# EAGLE design rizon (EAGLE 8.4.1)
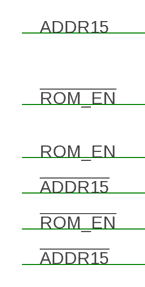
[diagram p0: schematic, sheet 1, part 1 of 2]
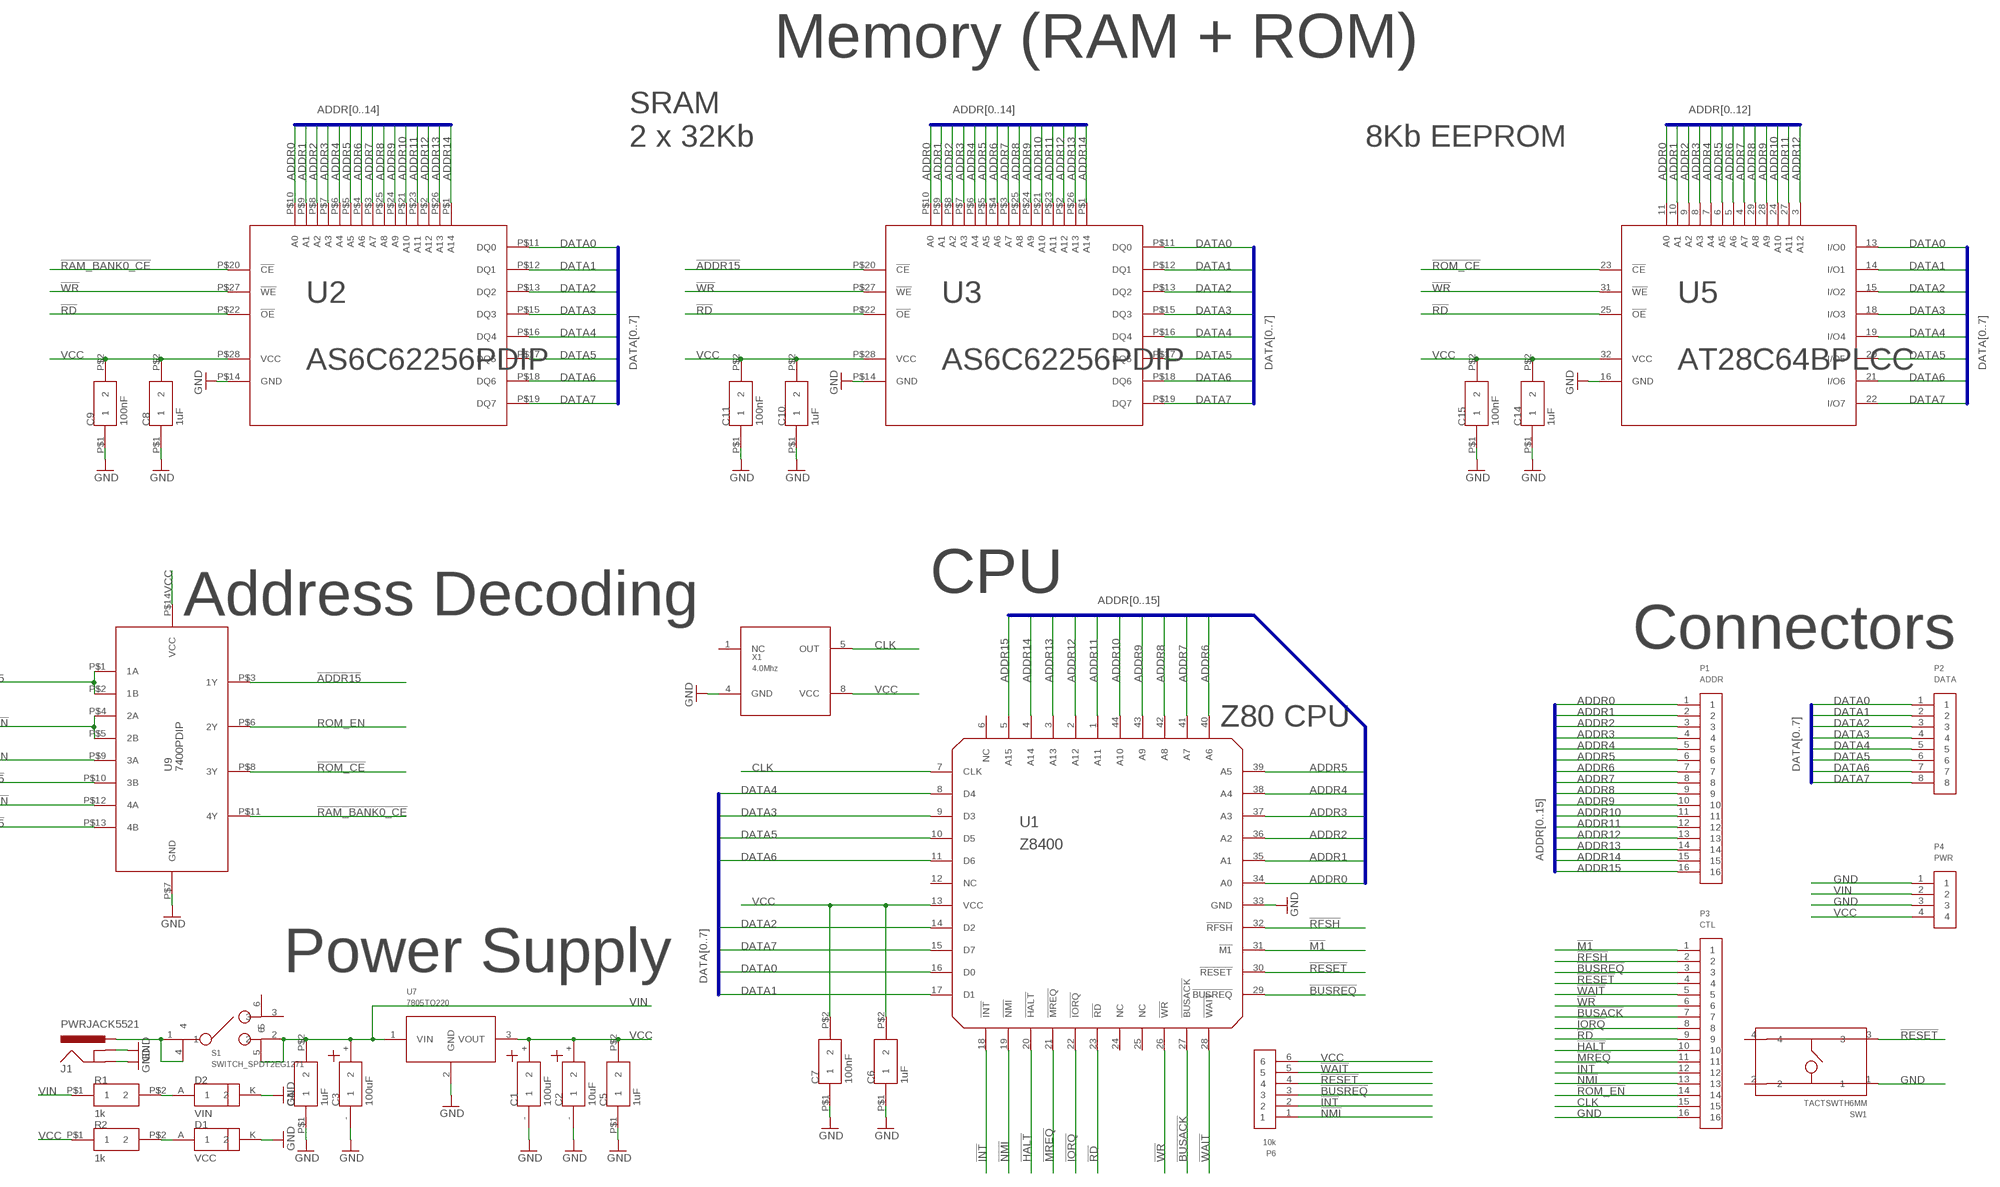
[diagram p1: schematic, sheet 1, part 2 of 2]

## Parts
C1  100uF  CAP_POLARIZEDRAD_5MM  [RADCAP_5MM]
C2  10uF  CAP_POLARIZEDRAD_5MM  [RADCAP_5MM]
C3  100uF  CAP_POLARIZEDRAD_5MM  [RADCAP_5MM]
C4  1uF  CAP508  [CAP_508]
C5  1uF  CAP508  [CAP_508]
C6  1uF  CAP508  [CAP_508]
C7  100nF  CAPDISC  [CAP_DISC]
C8  1uF  CAP508  [CAP_508]
C9  100nF  CAPDISC  [CAP_DISC]
C10  1uF  CAP508  [CAP_508]
C11  100nF  CAPDISC  [CAP_DISC]
C14  1uF  CAP508  [CAP_508]
C15  100nF  CAPDISC  [CAP_DISC]
D1  VCC  LED5MM  [LED5MM]
D2  VIN  LED5MM  [LED5MM]
J1  PWRJACK5521  [PWRJACK_5521]
P1  ADDR  PIN_16  [PIN_16]
P2  DATA  PIN_8  [PIN_8]
P3  CTL  PIN_16  [PIN_16]
P4  PWR  PIN_4  [PIN_4]
P6  10k  PIN_61LINE  [PIN_6]
R1  1k  RES8MM  [RES8MM]
R2  1k  RES8MM  [RES8MM]
S1  SWITCH_SPDT2EG1271  [EG1271]
SW1  TACTSWTH6MM  [SWITCH_6MM]
U1  Z8400  [PLCC-S44-SOCKET]
U2  AS6C62256PDIP  [PDIP28-600]
U3  AS6C62256PDIP  [PDIP28-600]
U5  AT28C64BPLCC  [PLCC-S32--SOCKET]
U7  7805TO220  [TO220V]
U9  7400PDIP  [PDIP14]
X1  4.0Mhz  OSC412.7  [OSC127]

## Nets
!ADDR15: U3.P$20(!CE) U9.P$3(1Y) U9.P$10(3B) U9.P$13(4B)
!BUSACK: P3.7 U1.27(!BUSACK)
!BUSREQ: P3.3 P6.3 U1.29(!BUSREQ)
!HALT: P3.10 U1.20(!HALT)
!INT: P3.12 P6.2 U1.18(!INT)
!IORQ: P3.8 U1.22(!IORQ)
!M1: P3.1 U1.31(!M1)
!MREQ: P3.11 U1.21(!MREQ)
!NMI: P3.13 P6.1 U1.19(!NMI)
!RAM_BANK0_CE: U2.P$20(!CE) U9.P$11(4Y)
!RD: P3.9 U1.23(!RD) U2.P$22(!OE) U3.P$22(!OE) U5.25(!OE)
!RESET: P3.4 P6.4 SW1.3 U1.30(!RESET)
!RFSH: P3.2 U1.32(!RFSH)
!ROM_CE: U5.23(!CE) U9.P$8(3Y)
!ROM_EN: P3.14 U9.P$4(2A) U9.P$5(2B) U9.P$12(4A)
!WAIT: P3.5 P6.5 U1.28(!WAIT)
!WR: P3.6 U1.26(!WR) U2.P$27(!WE) U3.P$27(!WE) U5.31(!WE)
ADDR0: P1.1 U1.34(A0) U2.P$10(A0) U3.P$10(A0) U5.11(A0)
ADDR1: P1.2 U1.35(A1) U2.P$9(A1) U3.P$9(A1) U5.10(A1)
ADDR2: P1.3 U1.36(A2) U2.P$8(A2) U3.P$8(A2) U5.9(A2)
ADDR3: P1.4 U1.37(A3) U2.P$7(A3) U3.P$7(A3) U5.8(A3)
ADDR4: P1.5 U1.38(A4) U2.P$6(A4) U3.P$6(A4) U5.7(A4)
ADDR5: P1.6 U1.39(A5) U2.P$5(A5) U3.P$5(A5) U5.6(A5)
ADDR6: P1.7 U1.40(A6) U2.P$4(A6) U3.P$4(A6) U5.5(A6)
ADDR7: P1.8 U1.41(A7) U2.P$3(A7) U3.P$3(A7) U5.4(A7)
ADDR8: P1.9 U1.42(A8) U2.P$25(A8) U3.P$25(A8) U5.29(A8)
ADDR9: P1.10 U1.43(A9) U2.P$24(A9) U3.P$24(A9) U5.28(A9)
ADDR10: P1.11 U1.44(A10) U2.P$21(A10) U3.P$21(A10) U5.24(A10)
ADDR11: P1.12 U1.1(A11) U2.P$23(A11) U3.P$23(A11) U5.27(A11)
ADDR12: P1.13 U1.2(A12) U2.P$2(A12) U3.P$2(A12) U5.3(A12)
ADDR13: P1.14 U1.3(A13) U2.P$26(A13) U3.P$26(A13)
ADDR14: P1.15 U1.4(A14) U2.P$1(A14) U3.P$1(A14)
ADDR15: P1.16 U1.5(A15) U9.P$1(1A) U9.P$2(1B)
CLK: P3.15 U1.7(CLK) X1.5(OUT)
DATA0: P2.1 U1.16(D0) U2.P$11(DQ0) U3.P$11(DQ0) U5.13(I/O0)
DATA1: P2.2 U1.17(D1) U2.P$12(DQ1) U3.P$12(DQ1) U5.14(I/O1)
DATA2: P2.3 U1.14(D2) U2.P$13(DQ2) U3.P$13(DQ2) U5.15(I/O2)
DATA3: P2.4 U1.9(D3) U2.P$15(DQ3) U3.P$15(DQ3) U5.18(I/O3)
DATA4: P2.5 U1.8(D4) U2.P$16(DQ4) U3.P$16(DQ4) U5.19(I/O4)
DATA5: P2.6 U1.10(D5) U2.P$17(DQ5) U3.P$17(DQ5) U5.20(I/O5)
DATA6: P2.7 U1.11(D6) U2.P$18(DQ6) U3.P$18(DQ6) U5.21(I/O6)
DATA7: P2.8 U1.15(D7) U2.P$19(DQ7) U3.P$19(DQ7) U5.22(I/O7)
GND: C1.- C2.- C3.- C4.P$1 C5.P$1 C6.P$1 C7.P$1 C8.P$1 C9.P$1 C10.P$1 C11.P$1 C14.P$1 C15.P$1 D1.K D2.K J1.GND J1.GNDBREAK P3.16 P4.1 P4.3 SW1.1 U1.33(GND) U2.P$14(GND) U3.P$14(GND) U5.16(GND) U7.2(GND) U9.P$7(GND) X1.4(GND)
N$1: D2.A R1.P$2
N$2: D1.A R2.P$2
N$4: J1.PWR S1.1 S1.4
ROM_EN: U9.P$6(2Y) U9.P$9(3A)
VCC: C1.+ C2.+ C5.P$2 C6.P$2 C7.P$2 C8.P$2 C9.P$2 C10.P$2 C11.P$2 C14.P$2 C15.P$2 P4.4 P6.6 R2.P$1 U1.13(VCC) U2.P$28(VCC) U3.P$28(VCC) U5.32(VCC) U7.3(VOUT) U9.P$14(VCC) X1.8(VCC)
VIN: C3.+ C4.P$2 P4.2 R1.P$1 S1.2 S1.5 U7.1(VIN)
Unconnected: S1.3 S1.6 SW1.2 SW1.4 U1.6(NC) U1.12(NC) U1.24(NC) U1.25(NC) X1.1(NC)

## Buses
DATA[0..7]
ADDR[0..15]
ADDR[0..14]
ADDR[0..12]

## Notes on the sheet
- Memory (RAM + ROM)
- SRAM
  2 x 32Kb
- 8Kb EEPROM
- CPU
- Address Decoding
- Connectors
- Z80 CPU
- Power Supply

## Library data of the parts
C1-C3 = dooba:CAP_POLARIZED
C4-C11 C14 C15 = dooba:CAP
D1 D2 = dooba:LED
J1 = dooba:PWRJACK
P1 P3 = dooba:PIN_16
P2 = dooba:PIN_8
P4 = dooba:PIN_4
P6 = dooba:PIN_6
R1 R2 = dooba:RES
S1 = dooba:SWITCH_SPDT2
SW1 = dooba:TACTSW
U1 = dooba:Z8400
U2 U3 = dooba:AS6C62256
U5 = dooba:AT28C64B
U7 = dooba:7805
U9 = dooba:7400
X1 = dooba:OSC4

## Board
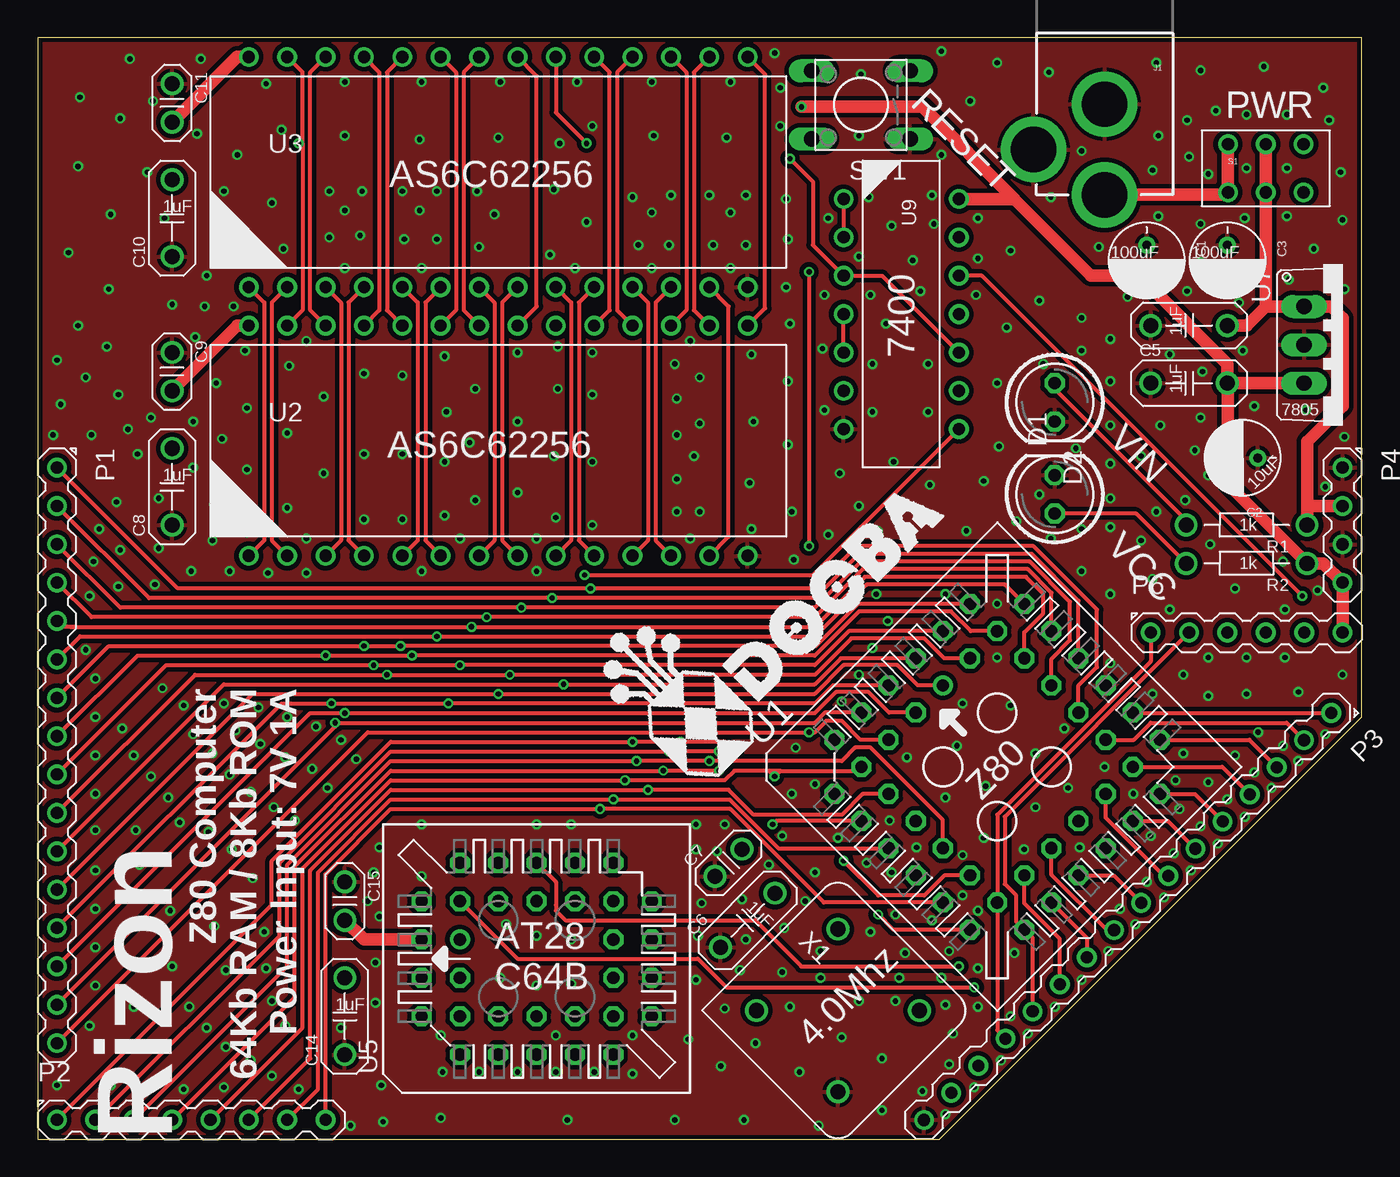
[diagram p2: board, top side]
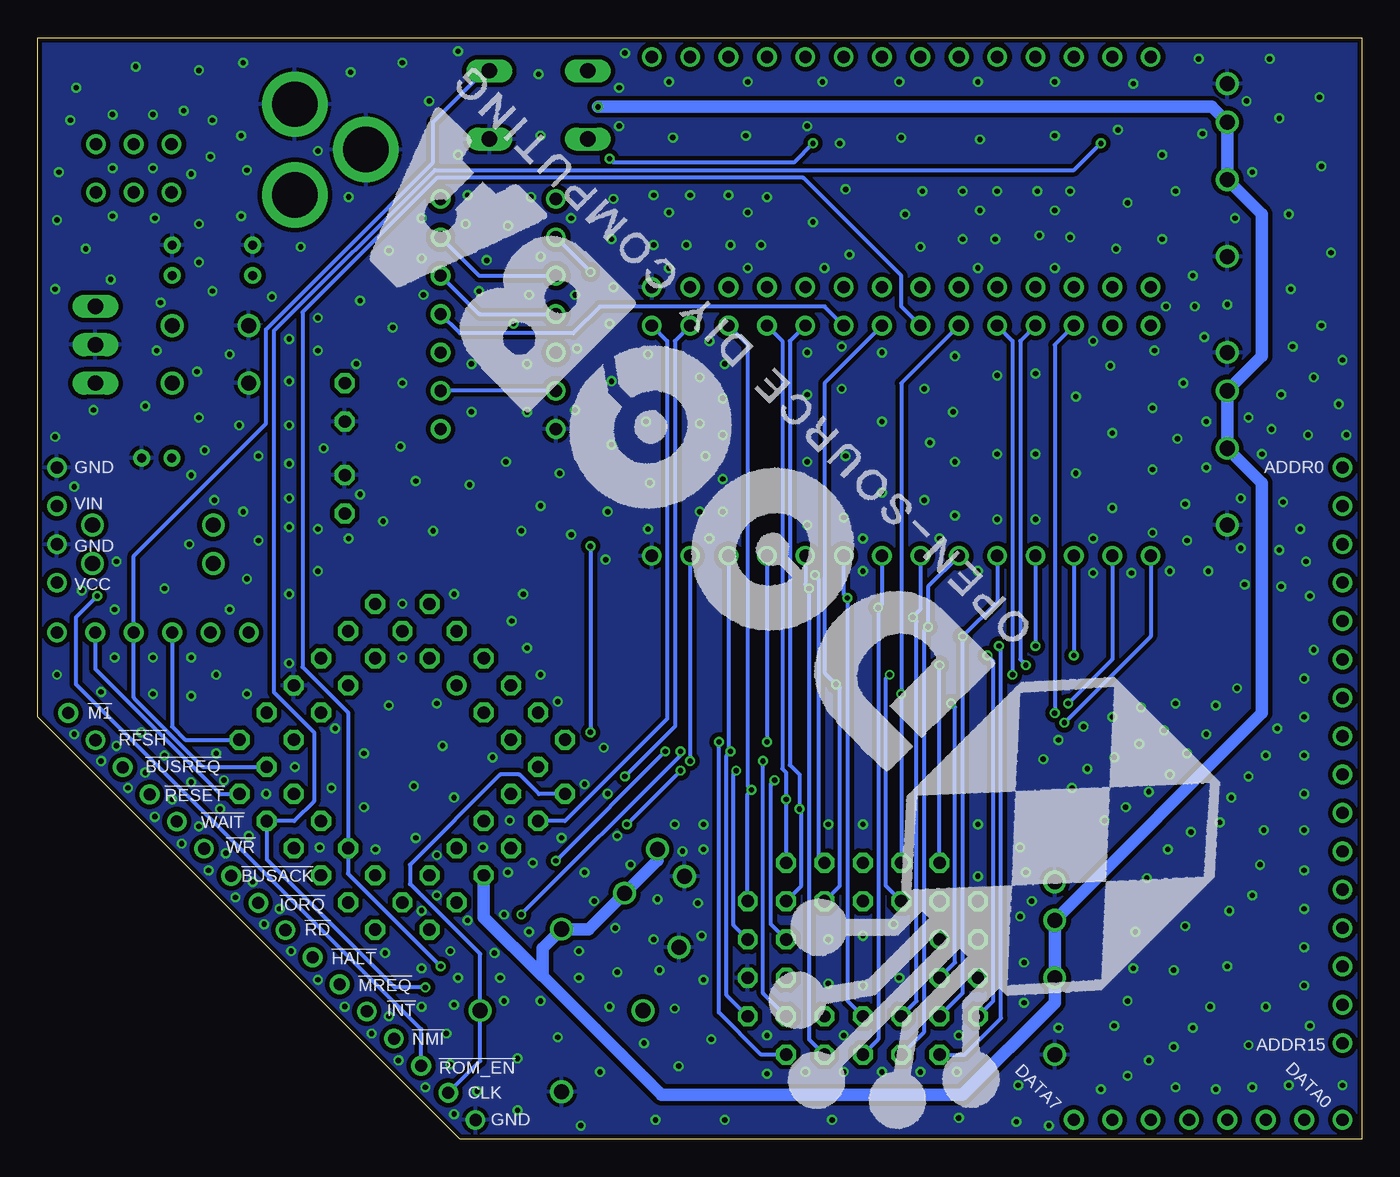
[diagram p3: board, bottom side, seen from below]

Size 87.63 x 72.9 mm. Coordinates in mm from the lower left corner, seen from the top.
Outline: 0,0 59.69,0 87.63,27.94 87.63,72.9 0,72.9 0,0
Copper layers (1*16): Top 0.035mm / dielectric 1.5mm / Bottom 0.035mm
Design rules "dooba": minimum track width 6mil, minimum drill 12mil, track to track 6mil, track to pad 6mil, pad to pad 6mil, via to via 6mil, smd to smd 0mil, copper to edge 10mil, drill to drill 10mil, minimum pad ring 10mil, minimum via ring 6mil, stop-mask expansion 2mil, vias tented up to drill 25mil, thermal gap 10mil

### Footprints (pad centres in the part's own frame; a part is rotated, then mirrored left to right if it is on the bottom)
RADCAP_5MM = drill 0.6: + 1,0; - -1,0
CAP_508 = drill 1: P$1 -2.54,0; P$2 2.54,0
CAP_DISC = drill 1: P$1 -1.27,0; P$2 1.27,0
LED5MM = drill 0.813 octagon: A -1.27,0; K 1.27,0
PWRJACK_5521 = drill 2.997 pad 4.318: GND 0,0.08; GNDBREAK 4.7,3.08; PWR 0,6.08
PIN_16 = drill 0.8: 1 -19.05,0; 2 -16.51,0; 3 -13.97,0; 4 -11.43,0; 5 -8.89,0; 6 -6.35,0; 7 -3.81,0; 8 -1.27,0; 9 1.27,0; 10 3.81,0; 11 6.35,0; 12 8.89,0; 13 11.43,0; 14 13.97,0; 15 16.51,0; 16 19.05,0
PIN_8 = drill 0.8: 1 -8.89,0; 2 -6.35,0; 3 -3.81,0; 4 -1.27,0; 5 1.27,0; 6 3.81,0; 7 6.35,0; 8 8.89,0
PIN_4 = drill 0.8: 1 -3.81,0; 2 -1.27,0; 3 1.27,0; 4 3.81,0
PIN_6 = drill 0.8: 1 -6.35,0; 2 -3.81,0; 3 -1.27,0; 4 1.27,0; 5 3.81,0; 6 6.35,0
RES8MM = drill 1: P$1 -4,0; P$2 4,0
EG1271 = drill 0.8: 1 -2.5,1.6; 2 0,1.6; 3 2.5,1.6; 4 -2.5,-1.6; 5 0,-1.6; 6 2.5,-1.6
SWITCH_6MM = drill 1.016 long: 1 -3.251,2.261; 2 3.251,2.261; 3 -3.251,-2.261; 4 3.251,-2.261
PLCC-S44-SOCKET = drill 0.813: 1 1.27,6.35 | drill 0.813 octagon: 2 -1.27,8.89; 3 -1.27,6.35; 4 -3.81,8.89; 5 -3.81,6.35; 6 -6.35,8.89; 7 -8.89,6.35; 8 -6.35,6.35; 9 -8.89,3.81; 10 -6.35,3.81; 11 -8.89,1.27; 12 -6.35,1.27; 13 -8.89,-1.27; 14 -6.35,-1.27; 15 -8.89,-3.81; 16 -6.35,-3.81; 17 -8.89,-6.35; 18 -6.35,-8.89; 19 -6.35,-6.35; 20 -3.81,-8.89; 21 -3.81,-6.35; 22 -1.27,-8.89; 23 -1.27,-6.35; 24 1.27,-8.89; 25 1.27,-6.35; 26 3.81,-8.89; 27 3.81,-6.35; 28 6.35,-8.89; 29 8.89,-6.35; 30 6.35,-6.35; 31 8.89,-3.81; 32 6.35,-3.81; 33 8.89,-1.27; 34 6.35,-1.27; 35 8.89,1.27; 36 6.35,1.27; 37 8.89,3.81; 38 6.35,3.81; 39 8.89,6.35; 40 6.35,8.89; 41 6.35,6.35; 42 3.81,8.89; 43 3.81,6.35; 44 1.27,8.89
PDIP28-600 = drill 0.8: P$1 -16.51,-7.62; P$2 -13.97,-7.62; P$3 -11.43,-7.62; P$4 -8.89,-7.62; P$5 -6.35,-7.62; P$6 -3.81,-7.62; P$7 -1.27,-7.62; P$8 1.27,-7.62; P$9 3.81,-7.62; P$10 6.35,-7.62; P$11 8.89,-7.62; P$12 11.43,-7.62; P$13 13.97,-7.62; P$14 16.51,-7.62; P$15 16.51,7.62; P$16 13.97,7.62; P$17 11.43,7.62; P$18 8.89,7.62; P$19 6.35,7.62; P$20 3.81,7.62; P$21 1.27,7.62; P$22 -1.27,7.62; P$23 -3.81,7.62; P$24 -6.35,7.62; P$25 -8.89,7.62; P$26 -11.43,7.62; P$27 -13.97,7.62; P$28 -16.51,7.62
PLCC-S32--SOCKET = drill 0.813: 1 1.27,5.08 | drill 0.813 octagon: 2 -1.27,7.62; 3 -1.27,5.08; 4 -3.81,7.62; 5 -6.35,5.08; 6 -3.81,5.08; 7 -6.35,2.54; 8 -3.81,2.54; 9 -6.35,0; 10 -3.81,0; 11 -6.35,-2.54; 12 -3.81,-2.54; 13 -6.35,-5.08; 14 -3.81,-7.62; 15 -3.81,-5.08; 16 -1.27,-7.62; 17 -1.27,-5.08; 18 1.27,-7.62; 19 1.27,-5.08; 20 3.81,-7.62; 21 6.35,-5.08; 22 3.81,-5.08; 23 6.35,-2.54; 24 3.81,-2.54; 25 6.35,0; 26 3.81,0; 27 6.35,2.54; 28 3.81,2.54; 29 6.35,5.08; 30 3.81,7.62; 31 3.81,5.08; 32 1.27,7.62
TO220V = drill 1.016 long: 1 -2.54,-2.54; 2 0,-2.54; 3 2.54,-2.54
PDIP14 = drill 0.8: P$1 -7.62,-3.81; P$2 -5.08,-3.81; P$3 -2.54,-3.81; P$4 0,-3.81; P$5 2.54,-3.81; P$6 5.08,-3.81; P$7 7.62,-3.81; P$8 7.62,3.81; P$9 5.08,3.81; P$10 2.54,3.81; P$11 0,3.81; P$12 -2.54,3.81; P$13 -5.08,3.81; P$14 -7.62,3.81
OSC127 = drill 1: 1 -3.81,-3.81; 4 3.81,-3.81; 5 3.81,3.81; 8 -3.81,3.81

### Placement (x,y rotation side)
C1  73.41,58.17 270 top
C2  79.76,45.09 180 top
C3  78.74,58.17 270 top
C4  76.2,53.85 0 top
C5  76.2,50.04 0 top
C6  46.99,14.48 45 top
C7  45.72,18.29 45 top
C8  8.89,43.18 90 top
C9  8.89,50.8 270 top
C10  8.89,60.96 90 top
C11  8.89,68.58 270 top
C14  20.32,8.13 90 top
C15  20.32,15.75 270 top
D1  67.31,42.67 90 top
D2  67.31,48.77 270 top
J1  70.61,68.58 180 top
P1  1.27,25.4 270 top
P2  10.16,1.27 0 top
P3  72.14,14.73 225 top
P4  86.36,40.64 270 top
P6  80.01,33.53 0 top
R1  80.01,40.64 180 top
R2  80.01,38.1 180 top
S1  81.28,64.26 0 top
SW1  54.48,68.45 180 top
U1  Z8400PLCC  [PLCC-S44-SOCKET]  63.5,24.64 45 top
U2  30.48,46.23 0 top
U3  30.48,64.01 0 top
U5  33.02,11.94 90 top
U7  86.36,52.58 270 top
U9  57.15,54.61 270 top
X1  52.96,8.51 315 top

### Tracks (layer width: path | path; a pad name or v marks a point on that pad's centre or on a via)
!ADDR15  (via drill 0.35)
  Top 0.254: U9.P$10 55.88,57.15 U9.P$3 51.31,59.18 51.31,63.37 v49.78,64.9 | U3.P$20 34.29,67.94 v36.32,65.91
  Bottom 0.254: U9.P$13 58.42,57.15 U9.P$3 | v49.78,64.9 49.53,64.64 37.59,64.64 v36.32,65.91
!BUSACK
  Top 0.254: U1.27 70.68,21.26 74.52,17.43 P3.7
!BUSREQ
  Top 0.254: U1.29 80.19,26.43 P3.3
  Bottom 0.254: U1.29 77.87,26.43 78.74,27.3 P6.3
!HALT
  Top 0.254: U1.20 69.44,13.31 P3.10
!INT
  Top 0.254: P6.2 64.01,21.34 64.01,16.89 64.77,16.13 64.77,14.39 U1.18 65.85,13.31 P3.12
!IORQ
  Top 0.254: U1.22 71.21,17.45 P3.8
!M1
  Top 0.254: U1.31 72.51,28.2 P3.1
!MREQ
  Top 0.254: U1.21 65.3,15.6 67.65,13.25 P3.11
!NMI
  Top 0.254: P6.1 73.66,31.62 63.5,21.46 U1.19 63.5,7.2 P3.13
!RAM_BANK0_CE
  Bottom 0.254: U2.P$20 35.56,55.12 50.42,55.12 52.2,53.34 59.69,53.34 U9.P$11
!RD  (via drill 0.35)
  Top 0.254: U1.23 67.09,17.49 70.75,13.83 P3.9 | U3.P$22 28.19,70.61 28.19,54.86 U2.P$22 | U5.25 34.29,17.02 34.29,15.49 34.29,15.11 34.92,14.48 47.5,14.48 50.55,11.43 v60.96,11.43
  Bottom 0.254: v60.96,11.43 67.09,17.56 U1.23 67.09,28.23 70.1,31.24 70.1,54.74 61.21,63.63 36.96,63.63 30.48,57.15 30.48,56.9 30.48,55.12 U2.P$22
!RESET
  Top 0.254: U1.30 78.39,24.64 P3.4
  Bottom 0.254: U1.30 76.71,24.64 81.28,29.21 P6.4 81.28,38.61 72.52,47.37 72.52,53.59 61.47,64.64 61.47,67.31 58.06,70.71 SW1.3
!RFSH
  Top 0.254: U1.32 72.53,26.43 73.66,27.56 82.66,27.56 P3.2
!ROM_CE  (via drill 0.35)
  Top 0.254: v36.2,37.34 51.31,37.34 U9.P$8
  Bottom 0.254: v36.2,37.34 35.97,37.11 35.97,18.69 U5.23
!ROM_EN  (via drill 0.35)
  Top 0.254: U9.P$5 U9.P$4 | v83.69,35.94 62.48,57.15 U9.P$12
  Bottom 0.254: P3.14 62.26,7.27 85.09,30.1 85.09,34.54 v83.69,35.94 | U9.P$12 58.42,54.61 U9.P$4
!WAIT
  Top 0.254: U1.28 76.6,22.84 P3.5
  Bottom 0.254: U1.28 75.55,22.84 83.82,31.11 P6.5
!WR  (via drill 0.35)
  Top 0.254: U3.P$27 17.53,70.61 17.53,65.91 | U2.P$27 17.53,54.86 17.53,65.91 | U1.26 74.8,21.05 P3.6 | U5.31 31.75,11.94 43.69,11.94 45.59,10.03 v61.98,10.03 | v17.27,65.91 17.53,65.91
  Bottom 0.254: v61.98,10.03 64.01,10.03 72.48,18.5 U1.26 70.65,21.05 69.34,22.35 69.34,26.92 72.01,29.59 72.01,53.47 61.34,64.14 19.05,64.14 v17.27,65.91
ADDR0  (via drill 0.35)
  Top 0.254: U1.34 68.89,30.03 70.1,31.24 70.1,35.05 65.91,39.24 54.23,39.24 51.44,36.45 v36.58,36.45 9.27,36.45 P1.1 | U3.P$10 35.81,55.37 35.81,39.62 U2.P$10
  Bottom 0.254: U5.11 36.58,6.6 v36.58,36.45 36.83,36.7 U2.P$10
ADDR1  (via drill 0.35)
  Top 0.254: U1.35 68.89,35.63 65.79,38.73 54.36,38.73 51.44,35.81 v34.04,35.81 7.37,35.81 P1.2 | U3.P$9 35.31,55.37 35.31,39.62 U2.P$9
  Bottom 0.254: U5.10 34.04,9.14 v34.04,35.81 34.29,36.07 U2.P$9
ADDR2  (via drill 0.35)
  Top 0.254: U1.36 67.09,31.79 68.33,33.02 68.33,35.56 65.66,38.23 54.48,38.23 51.44,35.18 v32,35.18 5.46,35.18 P1.3 | U3.P$8 30.73,55.37 30.73,39.62 U2.P$8
  Bottom 0.254: U5.9 32,6.6 v32,35.18 31.75,35.43 U2.P$8
ADDR3  (via drill 0.35)
  Top 0.254: U1.37 67.09,36.16 65.53,37.72 54.61,37.72 51.44,34.54 v29.72,34.54 3.56,34.54 P1.4 | U3.P$7 30.23,55.37 30.23,39.62 U2.P$7
  Bottom 0.254: U5.8 29.46,9.14 29.46,34.29 v29.72,34.54 29.21,35.05 U2.P$7
ADDR4  (via drill 0.35)
  Top 0.254: U1.38 65.3,33.55 66.55,34.8 66.55,36.07 65.41,37.21 54.74,37.21 51.44,33.91 v28.7,33.91 2.54,33.91 | U3.P$6 25.65,55.37 25.65,39.62 U2.P$6 | 2.16,33.91 2.54,33.91 | 2.54,33.91 1.65,33.91 P1.5
  Bottom 0.254: U5.7 28.96,7.11 28.96,33.66 v28.7,33.91 28.7,36.58 U2.P$6
ADDR5  (via drill 0.35)
  Top 0.254: U1.39 64.01,36.7 54.86,36.7 51.44,33.27 v26.42,33.27 2.79,33.27 P1.6 | U3.P$5 25.15,55.37 25.15,39.62 U2.P$5
  Bottom 0.254: U5.6 26.42,9.65 v26.42,33.27 24.13,35.56 U2.P$5
ADDR6  (via drill 0.35)
  Top 0.254: U1.40 54.27,35.41 51.49,32.64 v24,32.64 v21.59,32.64 4.7,32.64 P1.7 | U3.P$4 20.57,55.37 20.57,39.62 U2.P$4
  Bottom 0.254: U5.5 26.29,5.59 23.88,8 23.88,32.51 v24,32.64 | U2.P$4 v21.59,32.64
ADDR7  (via drill 0.35)
  Top 0.254: U1.41 61.76,33.62 60.45,34.92 54.36,34.92 51.44,32 v24.77,32 v19.05,32 6.6,32 P1.8 | U3.P$3 20.07,55.37 20.07,39.62 U2.P$3
  Bottom 0.254: U5.4 24.38,9.14 24.38,31.62 v24.77,32 | U2.P$3 v19.05,32
ADDR8  (via drill 0.35)
  Top 0.254: U1.42 53.68,33.62 51.44,31.37 v27.94,31.37 v22.23,31.37 8.51,31.37 P1.9 | U3.P$25 22.61,70.61 22.61,54.86 U2.P$25
  Bottom 0.254: U5.29 v27.94,31.37 | U2.P$25 22.61,52.83 22.61,31.75 v22.23,31.37
ADDR9  (via drill 0.35)
  Top 0.254: U1.43 60,31.82 58.67,33.15 53.85,33.15 51.44,30.73 v31.24,30.73 v23.11,30.73 10.41,30.73 P1.10 | U3.P$24 23.11,70.61 23.11,54.86 U2.P$24
  Bottom 0.254: U5.28 31.5,16.76 31.5,30.48 v31.24,30.73 | U2.P$24 23.11,52.83 v23.11,30.73
ADDR10  (via drill 0.35)
  Top 0.254: U1.44 53.16,31.82 51.44,30.1 v34.8,30.1 12.32,30.1 P1.11 | U2.P$21 33.02,55.12 33.02,70.36 U3.P$21
  Bottom 0.254: U5.24 34.54,16.76 34.54,29.84 v34.8,30.1 35.56,30.86 35.56,50.04 U2.P$21
ADDR11  (via drill 0.35)
  Top 0.254: U1.1 58.24,30.03 56.9,31.37 53.34,31.37 51.44,29.46 v30.48,29.46 14.22,29.46 P1.12 | U3.P$23 27.69,70.61 27.69,54.86 U2.P$23
  Bottom 0.254: U5.27 v30.48,29.46 30.48,50.04 U2.P$23
ADDR12  (via drill 0.35)
  Top 0.254: U1.2 52.63,30.03 51.44,28.83 v27.18,28.83 v19.43,28.83 16.13,28.83 P1.13 | U3.P$2 15.49,55.37 15.49,39.62 U2.P$2
  Bottom 0.254: U5.3 26.92,11.68 26.92,28.57 v27.18,28.83 | U2.P$2 16.51,31.75 v19.43,28.83
ADDR13  (via drill 0.35)
  Top 0.254: U1.3 56.35,28.23 54.99,29.59 52.83,29.59 51.44,28.19 v20.32,28.19 18.03,28.19 P1.14 | U2.P$26 18.03,54.86 18.03,70.61 U3.P$26
  Bottom 0.254: U2.P$26 20.32,52.58 v20.32,28.19
ADDR14  (via drill 0.35)
  Top 0.254: U1.4 52.11,28.23 51.44,27.56 v19.68,27.56 19.68,27.3 P1.15 | U3.P$1 14.99,55.37 14.99,39.62 U2.P$1
  Bottom 0.254: U2.P$1 13.97,33.27 v19.68,27.56
ADDR15  (via drill 0.35)
  Top 0.254: U1.5 54.47,26.43 53.21,27.69 52.2,27.69 51.44,26.92 v51.05,26.92 21.84,26.92 P1.16 | U9.P$1 U9.P$2 | v51.05,57.4 v51.05,39.24
  Bottom 0.254: U9.P$2 v51.05,57.4 | v51.05,39.24 v51.05,26.92
CLK
  Bottom 0.254: U1.7 54.47,22.84 55.75,24.13 57.02,24.13 62.99,18.16 62.99,16.89 58.35,12.25 X1.5 58.35,5.17 P3.15
DATA0  (via drill 0.35)
  Top 0.254: U1.16 60,17.45 58.67,16.13 55.63,16.13 v53.34,18.41 | v46.1,25.65 45.47,26.29 v42.55,26.29 v39.37,26.29 23.37,26.29 15.49,18.41 15.49,15.49 P2.1 | U3.P$11 40.39,55.37 40.39,39.62 U2.P$11
  Bottom 0.254: v53.34,18.41 v46.1,25.65 | U5.13 39.75,5.59 42.55,8.38 v42.55,26.29 | U2.P$11 v39.37,26.29
DATA1  (via drill 0.35)
  Top 0.254: U1.17 56.62,13.86 v55.63,14.86 | v45.09,25.65 v41.78,25.65 23.37,25.65 16,18.29 16,13.46 P2.2 | U3.P$12 40.89,55.37 40.89,39.62 U2.P$12
  Bottom 0.254: v45.09,25.65 45.09,25.4 v55.63,14.86 | U5.14 42.04,9.53 42.04,25.4 v41.78,25.65 41.91,25.78 U2.P$12
DATA2  (via drill 0.35)
  Top 0.254: U1.14 59.91,21.12 55.12,25.91 54.1,25.91 53.21,25.02 v44.45,25.02 v39.62,25.02 23.37,25.02 16.51,18.16 16.51,11.43 P2.3 | U2.P$13 45.72,39.88 45.72,55.12 U3.P$13
  Bottom 0.254: U5.15 39.62,9.65 v39.62,25.02 | U2.P$13 v44.45,25.02
DATA3  (via drill 0.35)
  Top 0.254: v45.09,24.38 v41.4,24.38 23.37,24.38 17.02,18.03 17.02,9.4 P2.4 | U1.9 48.86,21.05 v48.64,20.83 | U3.P$15 48.13,70.48 48.13,54.99 U2.P$15
  Bottom 0.254: v45.09,24.38 v48.64,20.83 | U5.18 41.58,14.15 41.58,24.21 v41.4,24.38 | U2.P$15 45.97,52.83 45.97,27.81 52.74,21.05 U1.9
DATA4  (via drill 0.35)
  Top 0.254: U1.8 54.27,24.38 49.15,24.38 | 49.15,24.38 48.39,24.38 | 48.39,24.38 46.1,24.38 45.47,23.75 v38.86,23.75 23.37,23.75 17.53,17.91 17.53,7.37 P2.5 | 48.39,24.38 v48.77,24 49.15,24.38 | U3.P$16 43.43,70.61 43.43,54.86 U2.P$16
  Bottom 0.254: U5.19 39.12,14.22 39.12,23.5 v38.86,23.75 | U2.P$16 45.47,52.83 45.47,27.3 v48.77,24
DATA5  (via drill 0.35)
  Top 0.254: U1.10 54.59,22.84 53.21,21.46 47.38,21.46 45.73,23.11 v40.39,23.11 23.37,23.11 18.03,17.78 18.03,5.33 P2.6 | U3.P$17 42.93,70.61 42.93,54.86 U2.P$17
  Bottom 0.254: U5.20 40.64,22.86 v40.39,23.11 40.64,23.37 40.64,52.58 U2.P$17
DATA6  (via drill 0.35)
  Top 0.254: U1.11 49.02,19.25 45.79,22.48 v38.1,22.48 23.37,22.48 18.54,17.65 18.54,3.3 P2.7 | U3.P$18 38.35,70.61 38.35,54.86 U2.P$18
  Bottom 0.254: U5.21 v38.1,22.48 38.1,24.26 38.35,24.51 38.35,52.83 U2.P$18
DATA7  (via drill 0.35)
  Top 0.254: U1.15 52.03,15.66 45.85,21.84 v37.21,21.84 23.37,21.84 19.05,17.53 P2.8 | U3.P$19 37.85,70.61 37.85,54.86 U2.P$19
  Bottom 0.254: U5.22 37.08,16.76 37.08,21.72 v37.21,21.84 37.21,24.13 37.85,24.77 37.85,52.83 U2.P$19
GND  (via drill 0.35)
  other vias: 66.04,21.97 65.28,19.18 68.2,23.24 68.96,19.3 72.52,22.86 70.61,24.64 58.17,19.3 56.39,21.08 50.16,25.91 51.44,23.5 49.91,22.86 52.96,19.94 56.52,17.65 54.86,18.29 56.77,14.86 55.12,13.72 50.8,15.75 51.44,17.65 61.21,18.8 62.61,19.94 57.53,25.27 63.5,31.88 67.94,27.18 66.04,25.53 61.21,28.83 60.07,22.61 60.83,26.04 62.74,23.37 64.39,28.7 63.5,35.43 56.26,34.29 60.07,36.07 55.5,36.07 55.24,32.51 54.36,30.73 53.21,28.96 55.63,40.26 69.09,37.59 69.09,40.39 67.06,39.75 66.29,42.67 59.05,43.31 61.47,40.26 62.61,43.56 64.77,40.89 63.63,45.85 68.71,45.72 70.99,42.42 70.99,40.51 70.99,44.7 70.99,31.5 70.99,36.07 73.03,39.62 77.6,39.37 82.55,35.05 74.93,35.05 79.25,36.45 73.79,37.08 74.04,41.53 75.95,42.29 73.03,45.21 70.99,47.24 70.99,50.16 70.99,52.96 69.09,52.2 69.09,54.36 62.23,60.96 62.23,58.29 64.39,58.8 66.29,55.5 62.1,55.88 66.55,51.31 64.14,53.72 63.5,50.04 55.24,51.31 58.93,51.31 55.24,48.13 58.93,48.13 56.13,53.98 55.12,55.88 58.42,56.13 57.91,58.17 54.36,58.42 52.07,55.88 51.94,52.32 52.07,48.26 52.32,40.01 53.09,44.07 56.64,44.83 54.36,41.91 73.79,29.46 77.47,31.88 80.01,31.88 82.55,31.88 80.01,29.46 77.47,29.34 75.82,30.73 86.36,30.73 83.44,29.59 80.77,26.92 75.82,25.53 79.25,25.4 80.52,24.26 82.42,26.04 78.74,22.48 77.47,23.62 75.31,23.75 75.56,21.84 76.96,20.7 73.66,20.07 75.18,18.92 73.41,17.02 71.63,15.24 64.64,12.32 64.39,8.13 62.23,8.76 60.33,4.95 60.07,8.89 60.58,6.99 59.18,14.48 61.21,16.13 62.23,15.11 60.33,12.45 62.23,11.3 57.02,10.67 59.82,10.67 51.82,10.67 49.28,11.05 57.4,12.32 51.82,12.45 46.61,15.88 43.94,15.62 49.4,13.97 46.86,13.21 46.48,11.18 43.69,13.46 48.39,18.16 49.28,20.07 45.47,20.83 44.96,19.05 43.56,19.18 85.22,26.8 83.44,25.02 81.66,23.24 79.88,21.34 78.11,19.56 76.33,17.78 74.55,16 72.64,14.22 70.87,12.45 69.09,10.54 67.31,8.76 65.53,6.99 63.75,5.21 61.98,3.43 60.07,1.65 58.55,3.17 56.77,9.14 54.36,9.14 49.78,8.76 47.5,6.35 45.47,8.64 43.56,10.54 39.37,4.32 43.05,6.6 45.21,4.83 46.74,1.27 50.42,4.45 51.69,0.89 55.88,1.91 53.21,6.73 55.88,5.33 42.16,1.27 35.05,1.27 26.67,1.4 31.75,4.45 34.29,4.45 36.83,4.45 29.21,4.45 26.8,4.45 26.67,6.86 34.29,6.86 39.37,6.86 20.07,7.37 20.7,0.89 22.86,1.14 22.73,3.56 22.35,9.02 30.61,10.67 33.02,10.16 35.31,10.29 35.31,13.21 33.02,13.46 30.99,14.22 25.4,17.4 22.35,11.68 22.61,14.73 22.61,19.3 21.84,15.75 22.23,17.65 25.4,20.83 33.02,20.83 35.31,20.83 43.56,20.83 1.27,3.56 17.27,3.3 15.49,4.19 12.32,3.43 16.38,7.49 12.45,6.1 9.65,3.3 15.49,9.14 7.24,3.43 11.18,7.37 15.11,11.3 14.1,5.21 4.83,3.56 7.49,6.22 10.03,8.76 12.45,11.18 14.99,13.72 3.43,7.49 6.35,8.76 8.89,11.43 11.68,14.1 14.22,17.27 3.81,10.16 12.83,19.18 8.76,15.11 7.24,16.13 11.3,20.32 3.81,12.7 3.81,15.24 3.81,17.78 3.81,20.45 3.81,22.86 3.81,25.4 3.81,27.94 3.81,30.48 3.17,32.38 3.43,35.94 3.68,38.23 4.06,40.39 5.21,42.16 7.49,47.75 6.6,45.34 1.02,46.61 3.56,46.61 5.97,46.99 1.52,48.64 5.33,49.28 3.17,50.42 1.27,51.56 4.57,52.45 2.67,53.85 4.7,56.26 8.89,55.24 12.95,55.12 11.18,57.15 10.41,53.09 11.05,55.12 16.26,58.93 12.32,62.74 8.38,60.96 10.54,66.55 16.13,66.8 15.49,61.98 13.21,65.15 13.21,59.56 7.24,64.01 4.83,61.21 7.62,68.71 10.79,71.5 6.1,71.5 5.46,67.56 2.67,64.39 2.03,58.67 2.79,68.96 6.73,18.16 9.4,20.95 8.64,22.61 7.49,24 6.35,25.4 5.59,27.18 6.48,20.45 21.08,25.15 17.02,21.08 19.18,23.24 15.62,21.97 20.07,26.42 18.16,24.51 14.1,22.99 16.38,25.27 18.41,27.3 16.51,27.94 12.7,24.13 14.73,26.16 13.08,27.05 14.61,28.57 11.56,25.53 10.29,26.8 12.32,28.83 8.26,29.84 9.65,28.7 7.75,36.7 5.33,36.58 5.46,38.99 8,42.42 8,39.12 10.16,37.59 12.7,37.59 15.24,37.47 17.78,37.47 25.4,37.59 33.02,37.59 50.04,38.35 47.24,40.39 49.91,41.53 47.12,43.43 43.18,39.75 36.7,40.64 36.7,49.28 36.7,44.83 42.29,43.69 43.81,47.37 42.16,51.31 43.18,52.83 43.81,41.53 42.29,49.02 43.43,45.21 42.29,46.61 43.81,50.42 42.29,41.53 49.78,53.98 47.24,51.94 49.66,50.16 47.37,47.5 49.66,45.97 36.7,52.07 34.42,52.45 31.75,52.07 34.42,49.66 31.75,47.5 34.16,45.21 31.75,42.8 34.29,41.15 33.02,39.75 26.92,51.82 28.96,49.66 27.94,39.75 28.96,42.29 26.92,44.83 27.05,48.13 28.57,46.1 26.92,41.27 24.13,41.02 24.13,45.34 24.13,50.55 21.59,50.67 21.59,45.34 21.59,41.02 17.78,39.75 17.78,52.83 16.64,51.18 18.92,49.15 16.51,46.74 18.92,44.07 16.51,41.78 11.56,39.62 13.84,40.13 10.29,44.45 10.29,47.5 11.81,50.04 13.72,52.2 13.84,48.39 13.84,44.32 12.19,46.35 11.68,42.04 49.53,56.39 45.85,57.66 40.64,57.66 35.56,57.66 25.4,57.66 20.32,57.66 49.53,62.23 49.66,59.56 52.32,60.96 54.99,62.36 59.18,62.48 59.31,60.58 56.52,60.45 54.36,66.42 54.48,70.48 48.77,71.88 49.15,69.6 49.15,67.06 59.82,65.15 59.82,72.01 61.72,68.71 67.06,62.36 70.23,59.05 63.5,71.25 66.93,70.61 74.17,61.09 76.07,56.13 79.5,55.37 79.76,52.2 77.09,50.8 77.47,43.94 74.3,47.24 76.96,47.75 76.58,45.59 74.93,51.94 80.52,48.51 83.95,48.26 82.8,56.9 86.49,56.26 82.68,61.09 86.36,60.83 84.45,58.93 86.23,64.01 82.68,64.26 80.01,64.26 79.88,60.96 77.47,63.88 69.09,65.41 73.79,64.14 74.17,66.42 76.2,65.02 77.98,68.07 76.07,67.44 80.01,67.82 82.68,67.82 85.47,67.44 76.96,60.58 76.96,58.04 72.14,55.75 85.22,43.18 86.49,46.48 82.42,38.23 84.71,36.32 76.96,70.74 85.09,69.6 81.15,70.99 74.04,71.25 20.32,66.42 25.27,66.17 30.48,66.29 34.54,65.91 36.7,67.06 40.77,66.42 45.59,66.29 40.64,61.34 45.85,61.34 34.16,62.87 36.32,60.71 30.23,61.21 25.27,61.47 20.32,61.47 19.3,59.69 19.3,62.74 21.46,62.74 21.34,59.82 24.13,62.74 24.26,59.56 26.42,59.56 26.42,62.74 29.08,62.74 29.21,59.05 33.91,58.55 39.75,59.18 39.37,62.36 41.91,62.48 41.78,59.18 44.7,59.18 44.45,62.48 46.86,62.48 46.86,59.18 15.11,69.85 20.32,69.98 25.4,69.98 30.61,69.98 35.69,69.98 40.64,69.98 45.85,69.98
  pour Top (isolate 0.305): 0,72.9 87.63,72.9 87.63,27.94 59.69,0 0,0
  pour Bottom (isolate 0.305): 0,72.9 87.63,72.9 87.63,27.94 59.69,0 0,0
N$1
  Top 0.254: R1.P$2 76.01,40.96 67.31,49.66 D2.A
N$2
  Top 0.254: R2.P$2 72.71,41.4 D1.A
N$4
  Top 0.813: J1.PWR 78.62,62.5 S1.4 S1.1
ROM_EN
  Bottom 0.254: U9.P$6 U9.P$9
VCC  (via drill 0.35)
  Top 0.813: C5.P$2 78.74,51.31 73.41,56.64 C1.+ 69.71,57.17 64.64,62.23 | C5.P$2 U7.3 | C5.P$2 78.76,50.02 C2.+ 78.76,43.35 R2.P$1 85.09,38.1 P4.4 P6.6 | 64.64,62.23 58.55,68.33 v50.55,68.33 | C11.P$2 13.21,71.63 U3.P$28 | C9.P$2 13.21,53.85 U2.P$28 | U9.P$14 64.64,62.23 | C15.P$2 21.59,13.21 U5.32
  Bottom 0.813: v50.55,68.33 9.91,68.33 C11.P$2 C10.P$2 6.6,61.21 6.6,51.82 C9.P$2 C8.P$2 6.6,43.43 6.6,28.19 C15.P$2 C14.P$2 20.32,9.02 26.42,2.92 46.35,2.92 54.23,10.79 | U1.13 58.11,14.68 54.23,10.79 | 54.23,10.79 54.23,12.63 X1.8 51.16,13.9 C6.P$2 46.62,18.44 C7.P$2
VIN
  Top 0.813: S1.2 S1.5 81.28,56.9 | 81.28,56.9 81.28,55.12 | C4.P$2 80.01,53.85 81.28,55.12 | 81.28,55.12 U7.1 85.6,55.12 86.36,54.36 86.36,48.51 84.01,46.16 84.01,42.04 | C3.+ 81.01,57.17 81.28,56.9 | 84.01,42.04 R1.P$1 | P4.2 84.14,41.91 84.01,42.04

### Text on the board
tPlace: RESET | PWR | AS6C62256 | 1uF | 100uF | 100uF | 7400 | 1uF | 1uF | 7805 | VIN | AS6C62256 | 1uF | 10uF | 1k | VCC | 1k | Z80 Computer / 64Kb RAM / 8Kb ROM / Power Input: 7V 1A | Z80 | Rizon | 1uF | AT28 / C64B | 1uF | 4.0Mhz
bPlace: ADDR0 | GND | VIN | GND | VCC | !M1 | !RFSH | !BUSREQ | !RESET | !WAIT | !WR | !BUSACK | !IORQ | !RD | !HALT | !MREQ | !INT | ADDR15 | !NMI | !ROM_EN | DATA0 | CLK | DATA7 | GND